# Altium project PCB_PROJECT1.PRJPCB
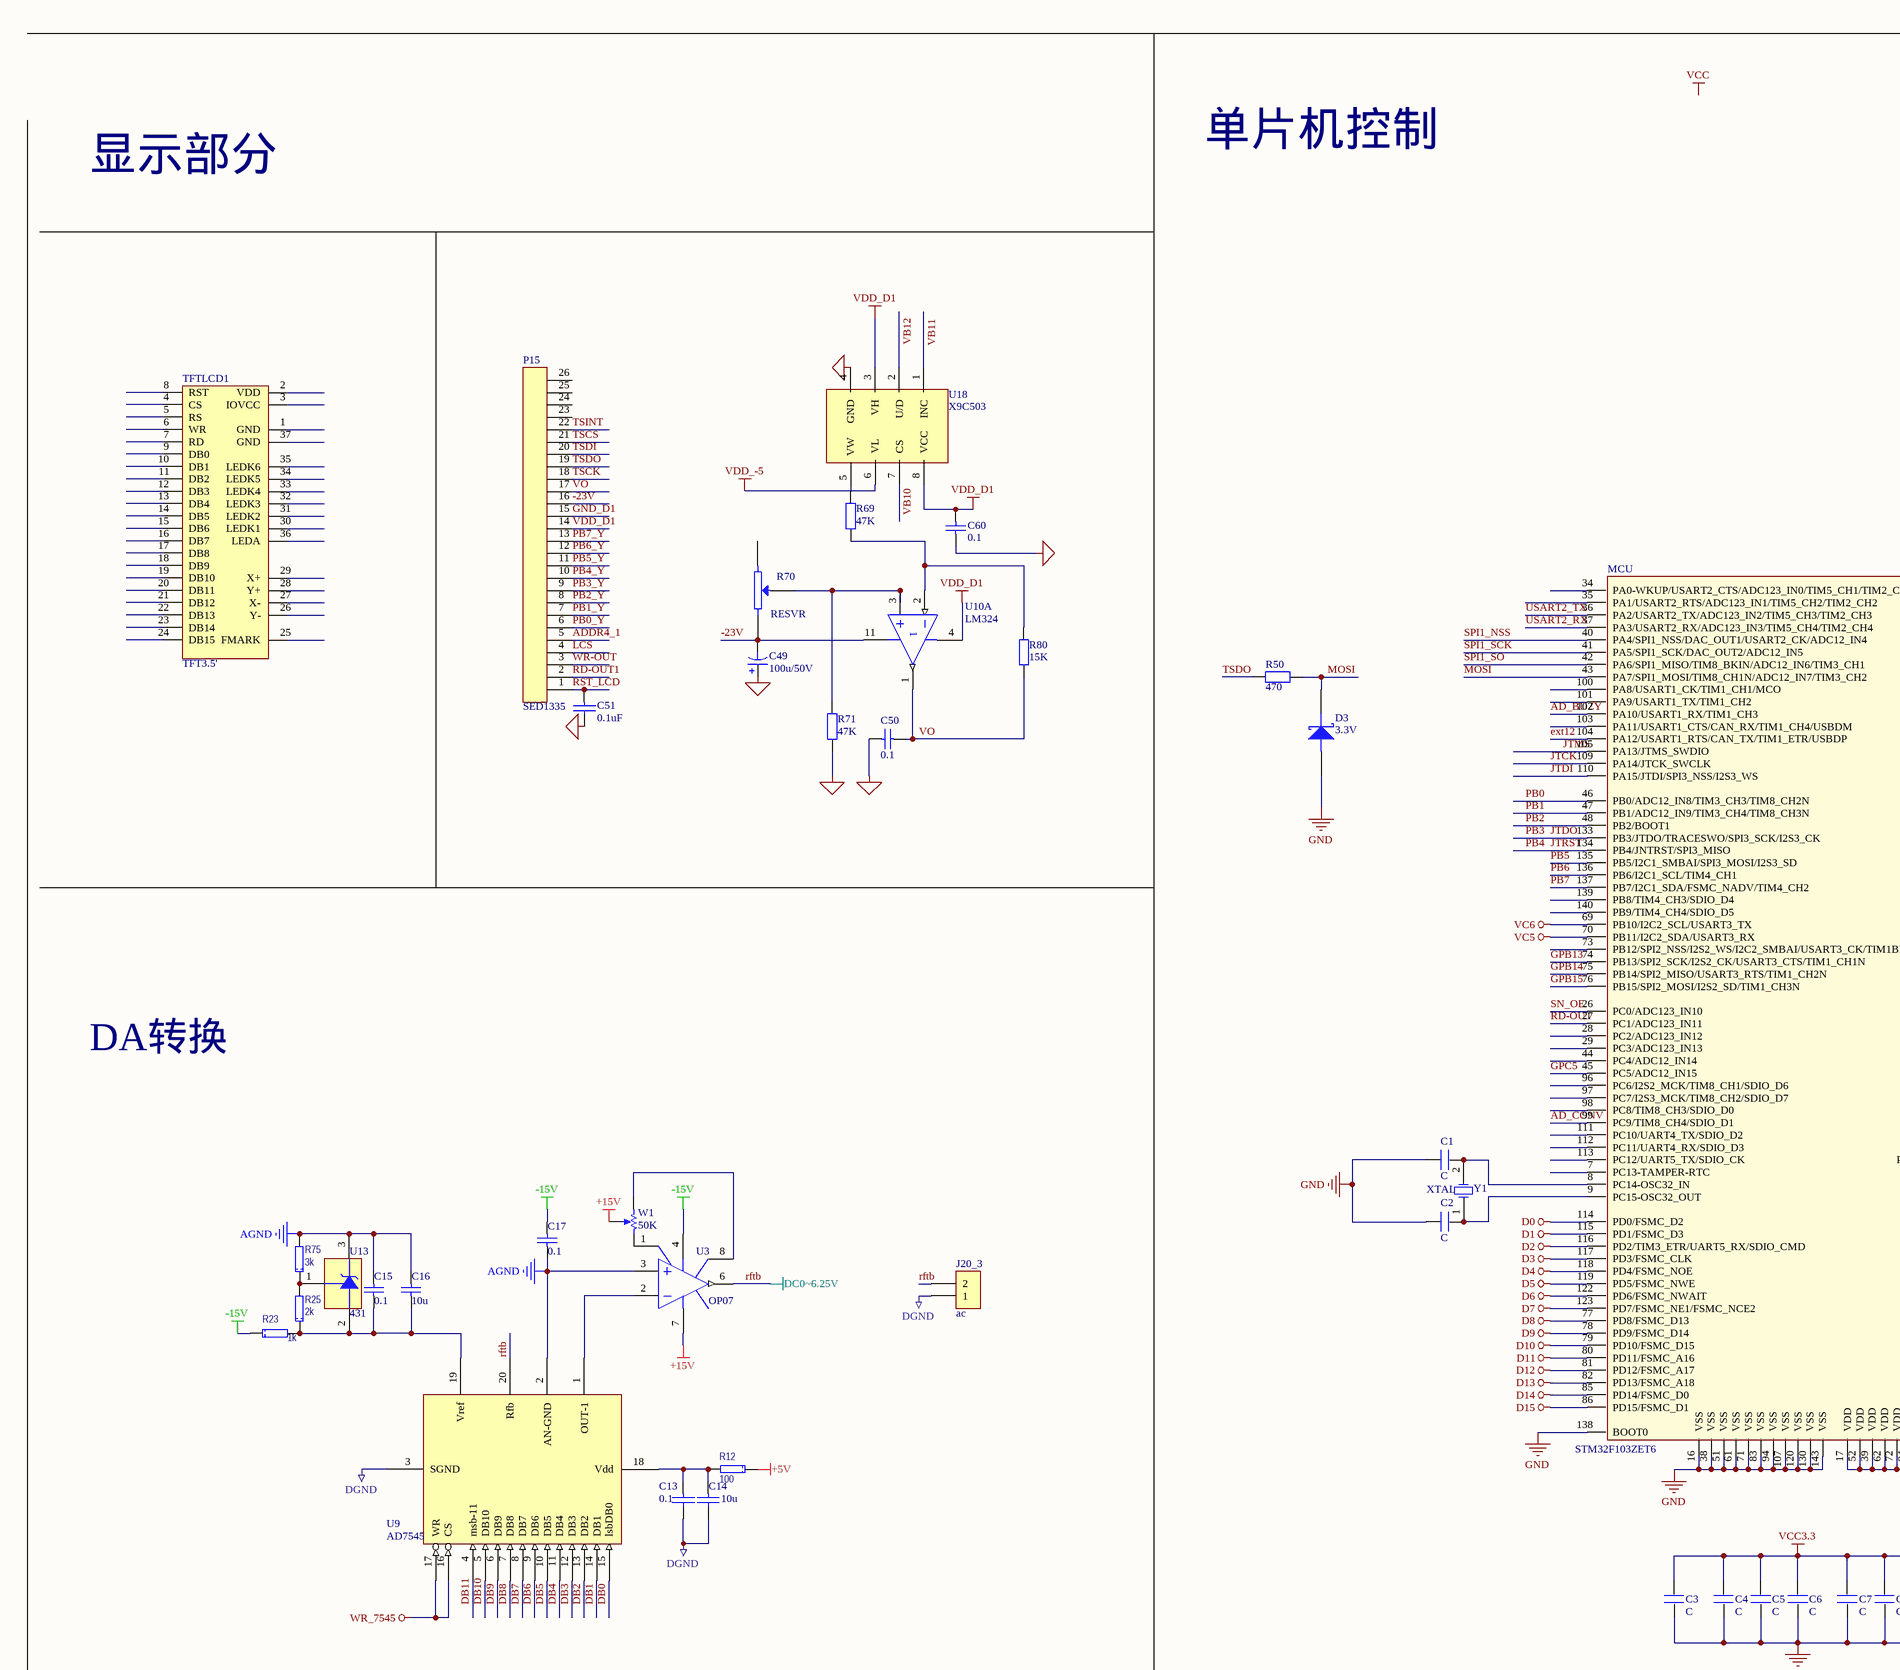
[diagram p0: T1.SCHDOC, top left]
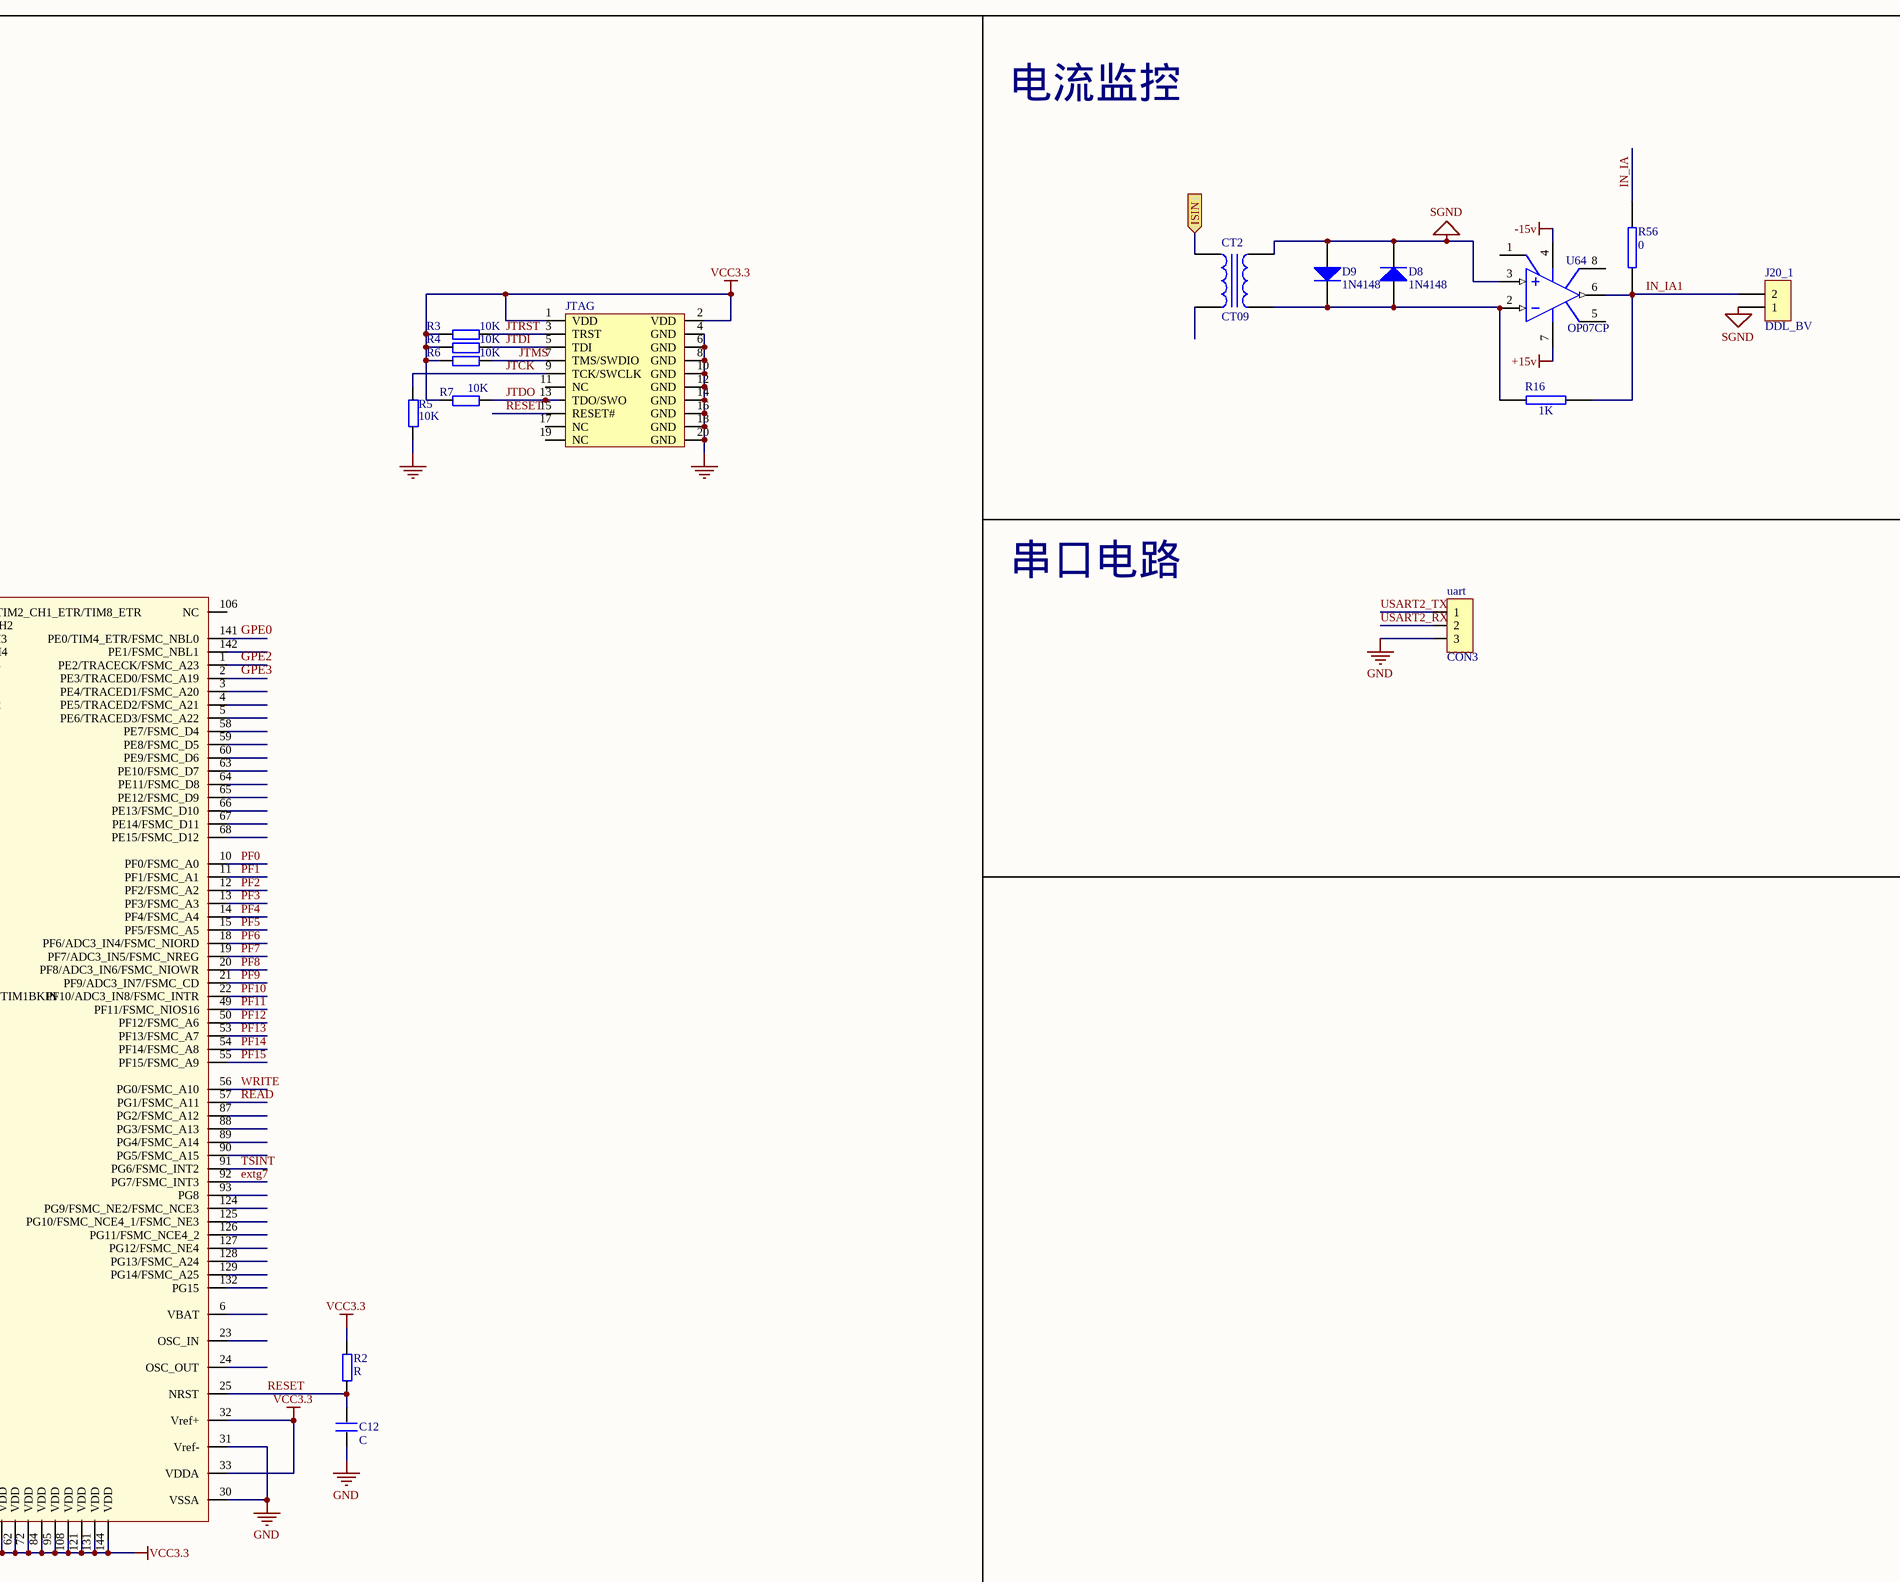
[diagram p1: T1.SCHDOC, top right]
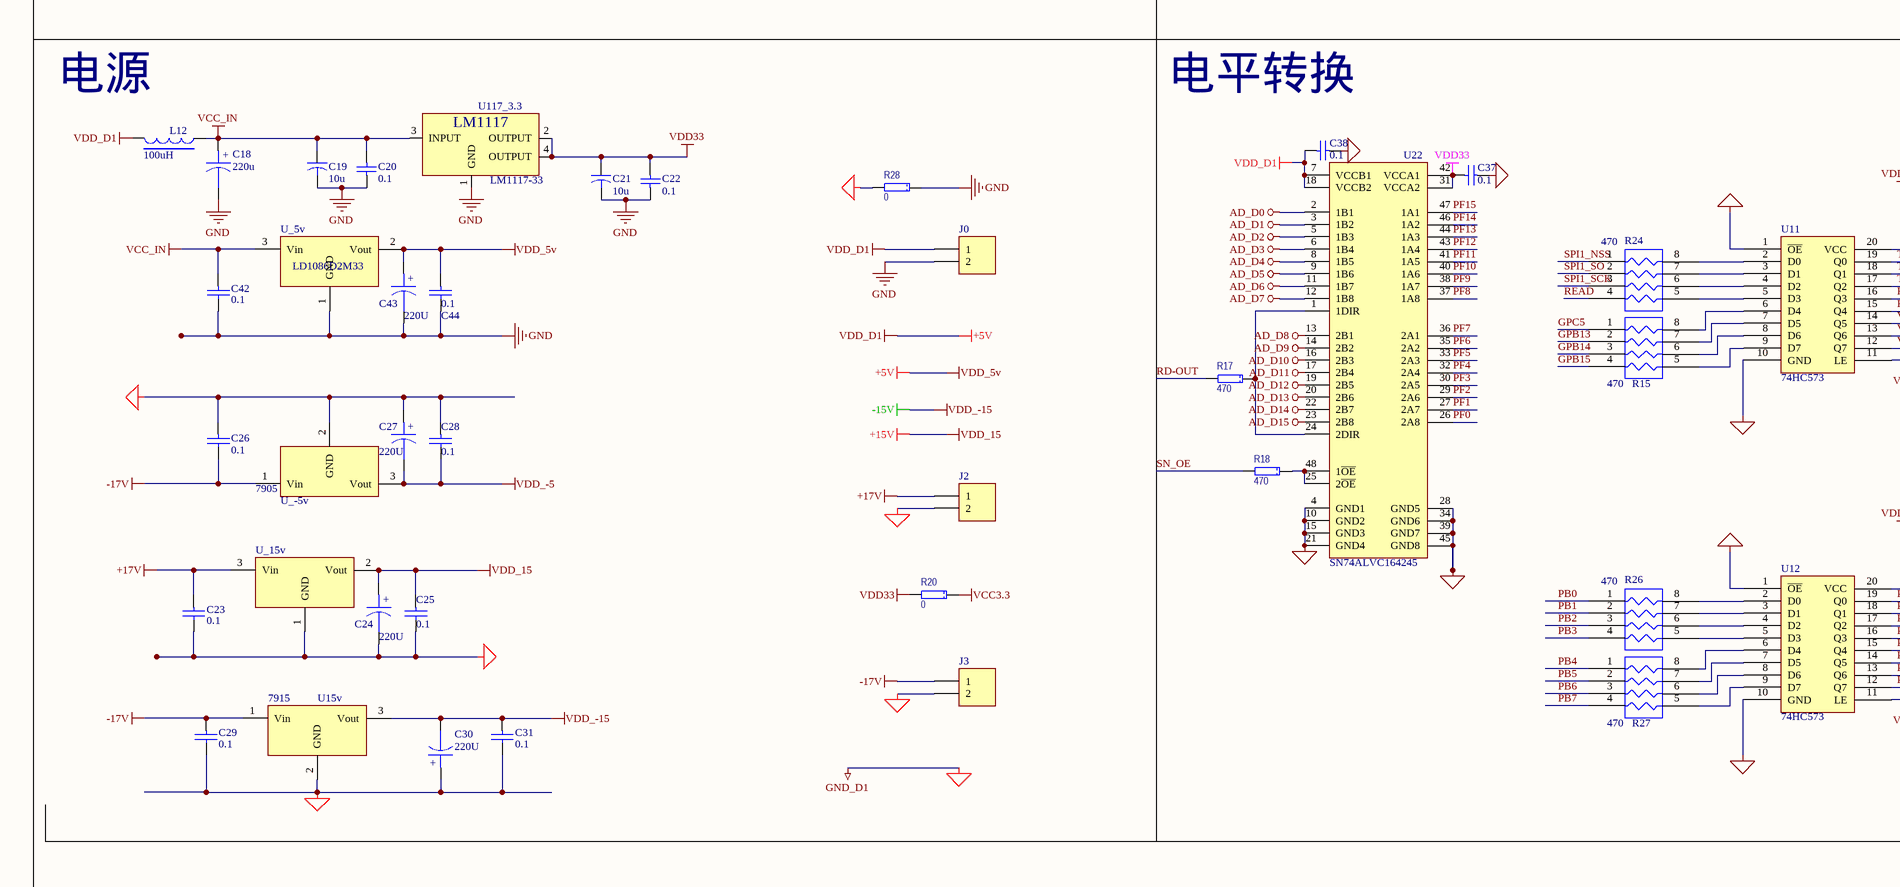
[diagram p2: T1.SCHDOC, bottom left]
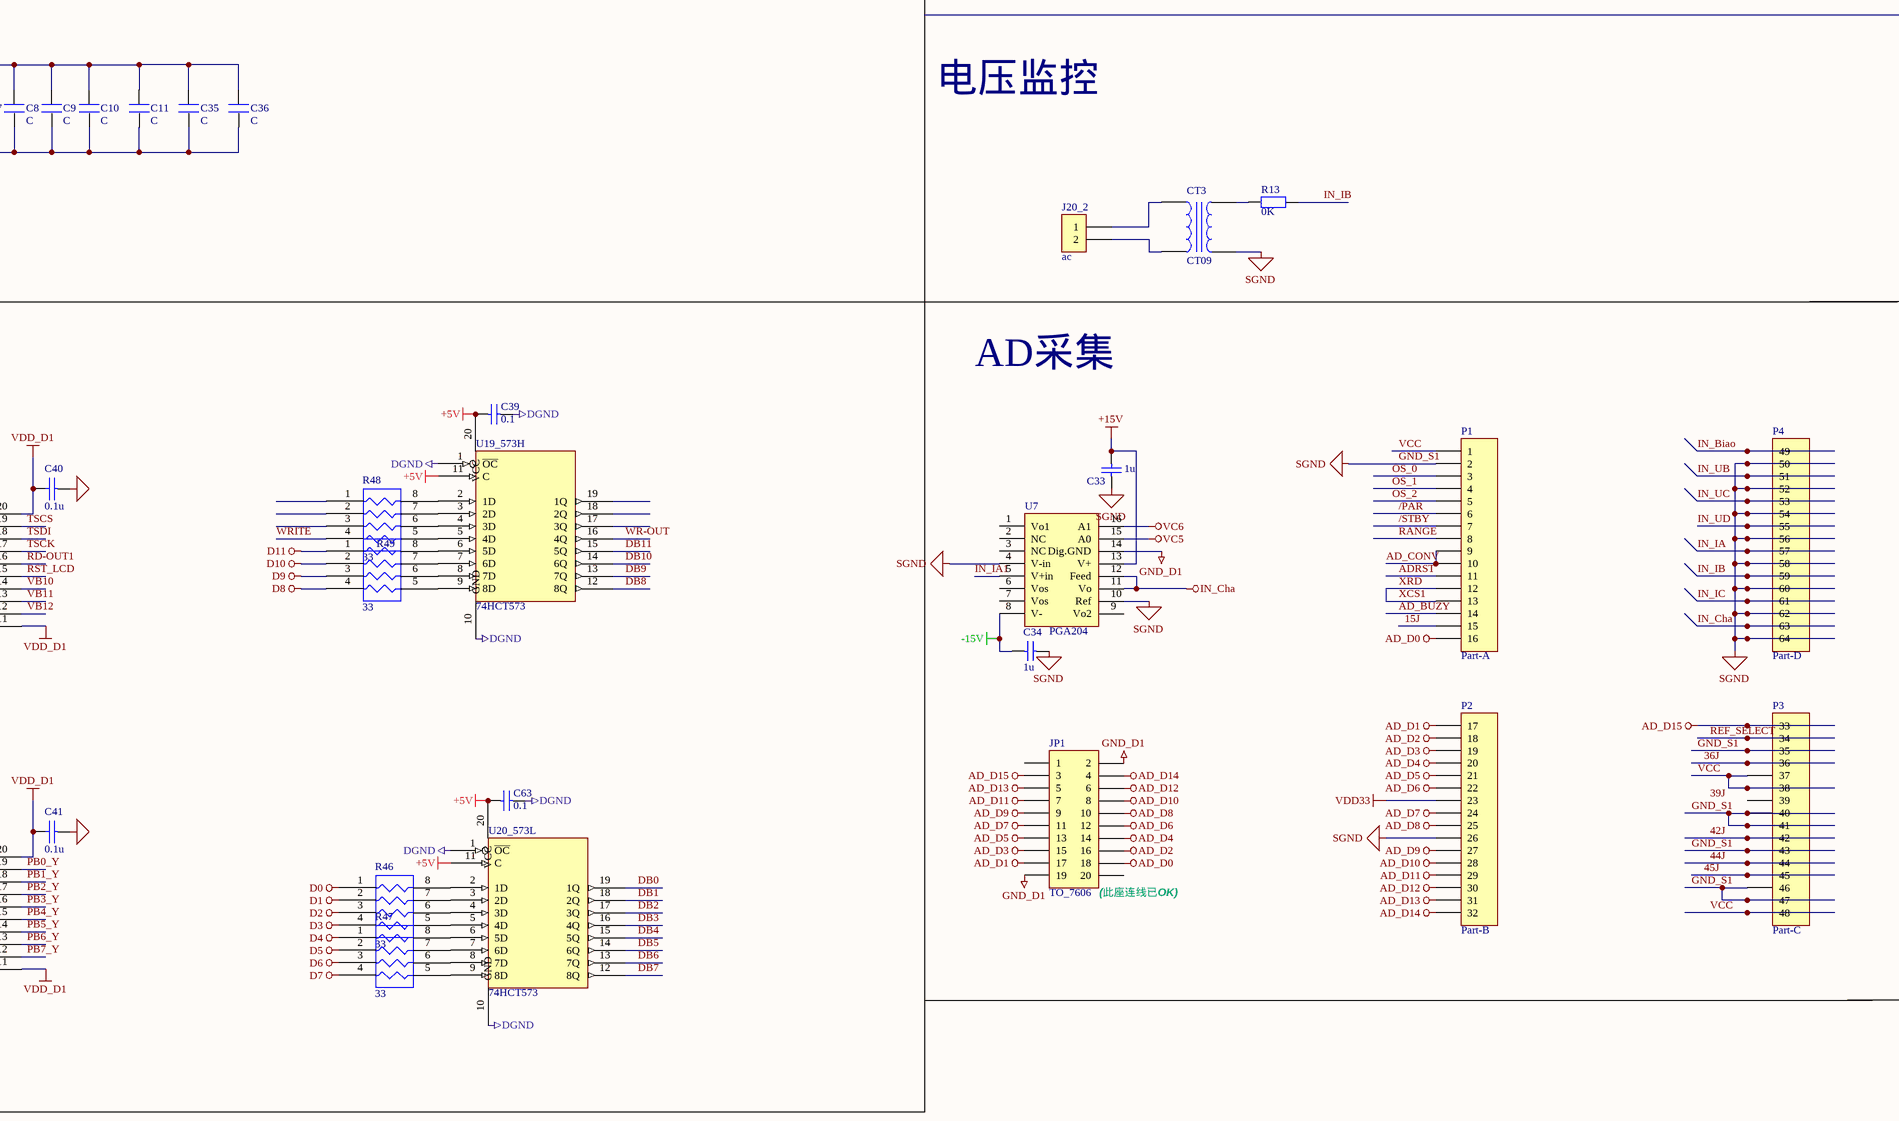
[diagram p3: T1.SCHDOC, bottom right]
1 sheet, 119 parts. Net scope: flat (ports and power ports of the same name join across sheets).
Board file: T1_MODIFYV1_0527.PCBDOC

## Sheet T1.SCHDOC
size A1

### Parts
C1  C  [0805]
C2  C  [0805]
C3  C  [0805]
C4  C  [0805]
C5  C  [0805]
C6  C  [0805]
C7  C  [0805]
C8  C  [0805]
C9  C  [0805]
C10  C  [0805]
C11  C  [0805]
C12  C  [0603P]
C13  0.1  [0805]
C14  10u  [0805]
C15  0.1  [0805]
C16  10u  [0805]
C17  0.1  [0805]
C18  220u  [C-RVE]
C19  10u  [c-1206]
C20  0.1  [0805]
C21  10u  [c-1206]
C22  0.1  [0805]
C23  0.1  [0805]
C24  220U  [CD10]
C25  0.1  [0805]
C26  0.1  [0805]
C27  220U  [CD4]
C28  0.1  [0805]
C29  0.1  [0805]
C30  220U  [CD4]
C31  0.1  [0805]
C33  1u  [0805]
C34  1u  [0805]
C35  C  [0805]
C36  C  [0805]
C37  0.1  [0805]
C38  0.1  [0805]
C39  0.1  [0805]
C40  0.1u  [0805]
C41  0.1u  [0805]
C42  0.1  [0805]
C43  220U  [CD10]
C44  0.1  [0805]
C49  100u/50V  [C-RVE]
C50  0.1  [0805]
C51  0.1uF  [0805]
C60  0.1  [0805]
C63  0.1  [0805]
CT2  CT09  [PCBComponent_1]
CT3  CT09  [tra1]
D3  3.3V  [DO-36]
D8  1N4148  [DO-41]
D9  1N4148  [DO-41]
J0  k TX  [HDR1X2]  (value not drawn)
J2  k TX  [HDR1X2]  (value not drawn)
J3  k TX  [HDR1X2]  (value not drawn)
J20_1  DDL_BV  [HDR1X2]
J20_2  ac  [RESVR]
J20_3  ac  [HDR1X2]
JP1  TO_7606  [IDC20_1]
JTAG  (no value)  [JTAG_20]
L12  100uH  [L1212]
MCU  STM32F103ZET6  [LQFP144]
P1  Part-A  [PARTA]
P2  Part-B  [PARTB]
P3  Part-C  [Part-C]
P4  Part-D  [Part-D]
P15  SED1335  [LCD_CM]
R2  R  [0805]
R3  10K  [0805]
R4  10K  [0805]
R5  10K  [0805]
R6  10K  [0805]
R7  10K  [0805]
R12  100  [0805]
R13  0K  [0805]
R15  470  [8P4R_0603]
R16  1K  [0805]
R17  470  [0805]
R18  470  [0805]
R20  0  [0805]
R23  1k  [0805]
R24  470  [8P4R_0603]
R25  2k  [0805]
R26  470  [8P4R_0603]
R27  470  [8P4R_0603]
R28  0  [0805]
R46  33  [8P4R_0603]
R47  33  [8P4R_0603]
R48  33  [8P4R_0603]
R49  33  [8P4R_0603]
R50  470  [0805]
R56  0  [0805]
R69  47K  [0805]
R70  RESVR  [RESVR]
R71  47K  [0805]
R75  3k  [0805]
R80  15K  [0805]
TFTLCD1  TFT3.5'  [TFT3.5']
U3  OP07  [DIP8]
U7  PGA204  [DIP16]
U9  AD7545  [DIP20]
U10  LM324  [SOP-14]  (part A of 4)
U11  74HC573  [SO20-7.5]
U12  74HC573  [SO20-7.5]
U13  431  [29-04]
U15v  7915  [TO220H]
U18  X9C503  [SOP127P600X175-8N]
U19_573H  74HCT573  [M20D]
U20_573L  74HCT573  [M20D]
U22  SN74ALVC164245  [SSOP48]
U64  OP07CP  [DIP8]
U117_3.3  LM1117-33  [SOT223]
U_5v  LD1086D2M33  [D2PAK/A]
U_15v  LD1086D2M33  [TO220F]  (value not drawn)
U_-5v  7905  [TO220H]
uart  CON3  [CON3]
W1  50K  [VR5]
Y1  XTAL  [XTAL_US]

### Ports
ISIN

### Nets
+15V: C24.1 C25.1 C33.2 U3.7(V+) U7.13(V+) U64.7(V+) U_15v.2(Vout) W1.2(TAP)  [also labelled VDD_15]
+17V: C23.1 J2.1 U_15v.3(Vin)
-15V: C17.2 C30.2 C31.1 C34.2 R23.1 U3.4(V-) U7.8(V-) U15v.3(Vout) U64.4(V-)  [also labelled VDD_-15]
-17V: C26.2 C29.1 J3.1 U15v.1(Vin) U_-5v.1(Vin)
AD_D0: JP1.18 P1.16 U22.2(1B1)
AD_D1: JP1.17 P2.17 U22.3(1B2)
AD_D2: JP1.16 P2.18 U22.5(1B3)
AD_D3: JP1.15 P2.19 U22.6(1B4)
AD_D4: JP1.14 P2.20 U22.8(1B5)
AD_D5: JP1.13 P2.21 U22.9(1B6)
AD_D6: JP1.12 P2.22 U22.11(1B7)
AD_D7: JP1.11 P2.24 U22.12(1B8)
AD_D8: JP1.10 P2.25 U22.13(2B1)
AD_D9: JP1.9 P2.27 U22.14(2B2)
AD_D10: JP1.8 P2.28 U22.16(2B3)
AD_D11: JP1.7 P2.29 U22.17(2B4)
AD_D12: JP1.6 P2.30 U22.19(2B5)
AD_D13: JP1.5 P2.31 U22.20(2B6)
AD_D14: JP1.4 P2.32 U22.22(2B7)
AD_D15: JP1.3 P3.33 U22.23(2B8)
AGND: C15.2 C16.2 C17.1 R75.2 U3.3(IN+) U9.2(AN-GND) U13.3(K)
D0: MCU.114(PD0/FSMC_D2) R46.1(R1)
D1: MCU.115(PD1/FSMC_D3) R46.2(R2)
D2: MCU.116(PD2/TIM3_ETR/UART5_RX/SDIO_CMD) R46.3(R3)
D3: MCU.117(PD3/FSMC_CLK) R46.4(R4)
D4: MCU.118(PD4/FSMC_NOE) R47.1(R1)
D5: MCU.119(PD5/FSMC_NWE) R47.2(R2)
D6: MCU.122(PD6/FSMC_NWAIT) R47.3(R3)
D7: MCU.123(PD7/FSMC_NE1/FSMC_NCE2) R47.4(R4)
D8: MCU.77(PD8/FSMC_D13) R49.4(R4)
D9: MCU.78(PD9/FSMC_D14) R49.3(R3)
D10: MCU.79(PD10/FSMC_D15) R49.2(R2)
D11: MCU.80(PD11/FSMC_A16) R49.1(R1)
D12: MCU.81(PD12/FSMC_A17)
D13: MCU.82(PD13/FSMC_A18)
D14: MCU.85(PD14/FSMC_D0)
D15: MCU.86(PD15/FSMC_D1)
DGND: C13.2 C14.2 C39.1 C63.1 J20_3.1 U9.3(SGND) U19_573H.1(~{OC}) U19_573H.10(GND) U20_573L.1(~{OC}) U20_573L.10(GND)
GND: C1.1 C2.1 C3.1 C4.1 C5.1 C6.1 C7.1 C8.1 C9.1 C10.1 C11.1 C12.1 C18.2 C19.2 C20.2 C21.2 C22.2 C35.1 C36.1 C42.2 C43.2 C44.2 D3.1(A) J0.2 JTAG.4(GND) JTAG.6(GND) JTAG.8(GND) JTAG.10(GND) JTAG.12(GND) JTAG.14(GND) JTAG.16(GND) JTAG.18(GND) JTAG.20(GND) MCU.16(VSS) MCU.30(VSSA) MCU.31(Vref-) MCU.38(VSS) MCU.51(VSS) MCU.61(VSS) MCU.71(VSS) MCU.83(VSS) MCU.94(VSS) MCU.107(VSS) MCU.120(VSS) MCU.130(VSS) MCU.138(BOOT0) MCU.143(VSS) R5.1 R28.1 U117_3.3.1(GND) U_5v.1(GND) uart.3
GND_D1: C23.2 C24.2 C25.2 C26.1 C27.1 C28.1 C29.2 C30.1 C31.2 C33.1 C34.1 C37.2 C38.2 C40.1 C41.1 C49.1 C50.1 C51.2 C60.1 CT2.2 CT3.1 D8.2(K) D9.1(A) J2.2 J3.2 J20_1.1 JP1.2 JP1.19 P1.2 P2.26 P3.35 P3.40 P3.41 P3.43 P3.46 P3.47 P4.50 P4.52 P4.54 P4.56 P4.58 P4.60 P4.62 P4.64 P15.15 R28.2 R71.2 U7.4(V-in) U7.10(Ref) U7.14(Dig.GND) U11.1(~{OE}) U11.10(GND) U12.1(~{OE}) U12.10(GND) U15v.2(GND) U18.4(GND) U22.4(GND1) U22.10(GND2) U22.15(GND3) U22.21(GND4) U22.28(GND5) U22.34(GND6) U22.39(GND7) U22.45(GND8) U64.3(IN+) U_15v.1(GND) U_-5v.2(GND)  [also labelled GND_S1, SGND]
IN_Cha: P4.63 U7.11(Vo) U7.12(Feed)
rftb: J20_3.2 U3.6(OUT) U9.20(Rfb)  [also labelled DC0~6.25V]
VC5: MCU.70(PB11/I2C2_SDA/USART3_RX) U7.15(A0)
VC6: MCU.69(PB10/I2C2_SCL/USART3_TX) U7.16(A1)
VCC: P1.1 P3.37 P3.38 P3.48
VCC3.3: C3.2 C4.2 C5.2 C6.2 C7.2 C8.2 C9.2 C10.2 C11.2 C35.2 C36.2 JTAG.1(VDD) JTAG.2(VDD) MCU.17(VDD) MCU.32(Vref+) MCU.33(VDDA) MCU.39(VDD) MCU.52(VDD) MCU.62(VDD) MCU.72(VDD) MCU.84(VDD) MCU.95(VDD) MCU.108(VDD) MCU.121(VDD) MCU.131(VDD) MCU.144(VDD) R2.2 R3.1 R4.1 R6.1 R7.1 R20.1
VCC_IN: C18.1 C19.1 C20.1 C42.1 L12.1 U117_3.3.3(INPUT) U_5v.3(Vin)
VDD33: C21.1 C22.1 C37.1 P2.23 R20.2 U22.31(VCCA2) U22.42(VCCA1) U117_3.3.2(OUTPUT) U117_3.3.4(OUTPUT)
VDD_-5: C27.2 C28.2 U18.6(VL) U_-5v.3(Vout)
VDD_D1: C38.1 C39.2 C40.2 C41.2 C43.1 C44.1 C60.2 C63.2 J0.1 L12.2 P15.14 R12.1 U10.4(V+) U11.11(LE) U11.20(VCC) U12.11(LE) U12.20(VCC) U18.3(VH) U18.8(VCC) U19_573H.11(C) U19_573H.20(VCC) U20_573L.11(C) U20_573L.20(VCC) U22.7(VCCB1) U22.18(VCCB2) U_5v.2(Vout)  [also labelled +5V, VDD_5v]
WR_7545: U9.16(CS) U9.17(WR)
15J: P1.15
36J: P3.36
42J: P3.42
44J: P3.44
45J: P3.45
-23V: C49.2 P15.16 R70.2 U10.11(V-)
/PAR: P1.6
/STBY: P1.7
AD_BUZY: MCU.102(PA10/USART1_RX/TIM1_CH3) P1.14
AD_CONV: MCU.99(PC9/TIM8_CH4/SDIO_D1) P1.9 P1.10
ADDR4_1: P15.5
ADRST: P1.11
DB0: U9.15(lsbDB0) U20_573L.19(1Q)
DB1: U9.14(DB1) U20_573L.18(2Q)
DB2: U9.13(DB2) U20_573L.17(3Q)
DB3: U9.12(DB3) U20_573L.16(4Q)
DB4: U9.11(DB4) U20_573L.15(5Q)
DB5: U9.10(DB5) U20_573L.14(6Q)
DB6: U9.9(DB6) U20_573L.13(7Q)
DB7: U9.8(DB7) U20_573L.12(8Q)
DB8: U9.7(DB8) U19_573H.12(8Q)
DB9: U9.6(DB9) U19_573H.13(7Q)
DB10: U9.5(DB10) U19_573H.14(6Q)
DB11: U9.4(msb-11) U19_573H.15(5Q)
ext12: MCU.104(PA12/USART1_RTS/CAN_TX/TIM1_ETR/USBDP)
extg7: MCU.92(PG7/FSMC_INT3)
GPB13: MCU.74(PB13/SPI2_SCK/I2S2_CK/USART3_CTS/TIM1_CH1N) R15.2(R2)
GPB14: MCU.75(PB14/SPI2_MISO/USART3_RTS/TIM1_CH2N) R15.3(R3)
GPB15: MCU.76(PB15/SPI2_MOSI/I2S2_SD/TIM1_CH3N) R15.4(R4)
GPC5: MCU.45(PC5/ADC12_IN15) R15.1(R1)
GPE0: MCU.141(PE0/TIM4_ETR/FSMC_NBL0)
GPE2: MCU.1(PE2/TRACECK/FSMC_A23)
GPE3: MCU.2(PE3/TRACED0/FSMC_A19)
IN_Biao: P4.49
IN_IA: P4.57 R56.2
IN_IA1: J20_1.2 R16.2 R56.1 U7.5(V+in) U64.6(OUT)
IN_IB: P4.59 R13.2
IN_IC: P4.61
IN_UB: P4.51
IN_UC: P4.53
IN_UD: P4.55
JTCK: JTAG.9(TCK/SWCLK) MCU.109(PA14/JTCK_SWCLK) R5.2
JTDI: JTAG.5(TDI) MCU.110(PA15/JTDI/SPI3_NSS/I2S3_WS) R4.2
JTDO: JTAG.13(TDO/SWO) MCU.133(PB3/JTDO/TRACESWO/SPI3_SCK/I2S3_CK) R7.2 R26.4(R4)  [also labelled PB3]
JTMS: JTAG.7(TMS/SWDIO) MCU.105(PA13/JTMS_SWDIO) R6.2
JTRST: JTAG.3(TRST) MCU.134(PB4/JNTRST/SPI3_MISO) R3.2 R27.1(R1)  [also labelled PB4]
LCS: P15.4
MOSI: D3.2(K) MCU.43(PA7/SPI1_MOSI/TIM8_CH1N/ADC12_IN7/TIM3_CH2) R50.2
OS_0: P1.3
OS_1: P1.4
OS_2: P1.5
PB0: MCU.46(PB0/ADC12_IN8/TIM3_CH3/TIM8_CH2N) R26.1(R1)
PB0_Y: P15.6 U12.19(Q0)
PB1: MCU.47(PB1/ADC12_IN9/TIM3_CH4/TIM8_CH3N) R26.2(R2)
PB1_Y: P15.7 U12.18(Q1)
PB2: MCU.48(PB2/BOOT1) R26.3(R3)
PB2_Y: P15.8 U12.17(Q2)
PB3_Y: P15.9 U12.16(Q3)
PB4_Y: P15.10 U12.15(Q4)
PB5: MCU.135(PB5/I2C1_SMBAI/SPI3_MOSI/I2S3_SD) R27.2(R2)
PB5_Y: P15.11 U12.14(Q5)
PB6: MCU.136(PB6/I2C1_SCL/TIM4_CH1) R27.3(R3)
PB6_Y: P15.12 U12.13(Q6)
PB7: MCU.137(PB7/I2C1_SDA/FSMC_NADV/TIM4_CH2) R27.4(R4)
PB7_Y: P15.13 U12.12(Q7)
PF0: MCU.10(PF0/FSMC_A0) U22.26(2A8)
PF1: MCU.11(PF1/FSMC_A1) U22.27(2A7)
PF2: MCU.12(PF2/FSMC_A2) U22.29(2A6)
PF3: MCU.13(PF3/FSMC_A3) U22.30(2A5)
PF4: MCU.14(PF4/FSMC_A4) U22.32(2A4)
PF5: MCU.15(PF5/FSMC_A5) U22.33(2A3)
PF6: MCU.18(PF6/ADC3_IN4/FSMC_NIORD) U22.35(2A2)
PF7: MCU.19(PF7/ADC3_IN5/FSMC_NREG) U22.36(2A1)
PF8: MCU.20(PF8/ADC3_IN6/FSMC_NIOWR) U22.37(1A8)
PF9: MCU.21(PF9/ADC3_IN7/FSMC_CD) U22.38(1A7)
PF10: MCU.22(PF10/ADC3_IN8/FSMC_INTR) U22.40(1A6)
PF11: MCU.49(PF11/FSMC_NIOS16) U22.41(1A5)
PF12: MCU.50(PF12/FSMC_A6) U22.43(1A4)
PF13: MCU.53(PF13/FSMC_A7) U22.44(1A3)
PF14: MCU.54(PF14/FSMC_A8) U22.46(1A2)
PF15: MCU.55(PF15/FSMC_A9) U22.47(1A1)
RANGE: P1.8
RD-OUT: MCU.27(PC1/ADC123_IN11) R17.2
RD-OUT1: P15.2 U11.16(Q3)
READ: MCU.57(PG1/FSMC_A11) R24.4(R4)
REF_SELECT: P3.34
RESET: C12.2 JTAG.15(RESET#) MCU.25(NRST) R2.1
RST_LCD: C51.1 P15.1 U11.15(Q4)
SN_OE: MCU.26(PC0/ADC123_IN10) R18.2
SPI1_NSS: MCU.40(PA4/SPI1_NSS/DAC_OUT1/USART2_CK/ADC12_IN4) R24.1(R1)
SPI1_SCK: MCU.41(PA5/SPI1_SCK/DAC_OUT2/ADC12_IN5) R24.3(R3)
SPI1_SO: MCU.42(PA6/SPI1_MISO/TIM8_BKIN/ADC12_IN6/TIM3_CH1) R24.2(R2)
TSCK: P15.18 U11.17(Q2)
TSCS: P15.21 U11.19(Q0)
TSDI: P15.20 U11.18(Q1)
TSDO: P15.19 R50.1
TSINT: MCU.91(PG6/FSMC_INT2) P15.22
USART2_RX: MCU.37(PA3/USART2_RX/ADC123_IN3/TIM5_CH4/TIM2_CH4) uart.2
USART2_TX: MCU.36(PA2/USART2_TX/ADC123_IN2/TIM5_CH3/TIM2_CH3) uart.1
VB10: U11.14(Q5) U18.7(CS)
VB11: U11.13(Q6) U18.1(INC)
VB12: U11.12(Q7) U18.2(U/D)
VO: C50.2 P15.17 R80.2 U10.1(OUT)
WR-OUT: P15.3 U19_573H.16(4Q)
WRITE: MCU.56(PG0/FSMC_A10) R48.4(R4)
XCS1: P1.12 P1.13  [also labelled XRD]
NetC1_2: C1.2 MCU.8(PC14-OSC32_IN) Y1.2(OSC2)
NetC2_2: C2.2 MCU.9(PC15-OSC32_OUT) Y1.1(OSC1)
NetC13_1: C13.1 C14.1 R12.2 U9.18(Vdd)
NetC15_1: C15.1 C16.1 R23.2 R25.1 U9.19(Vref) U13.2(A)
NetCT2_1: CT2.1 D8.1(A) D9.2(K) R16.1 U64.2(IN-)
NetCT2_3: CT2.3 ; port ISIN
NetCT3_2: CT3.2 R13.1
NetCT3_3: CT3.3 J20_2.1
NetCT3_4: CT3.4 J20_2.2
NetR15_5: R15.5(R4) U11.9(D7)
NetR15_6: R15.6(R3) U11.8(D6)
NetR15_7: R15.7(R2) U11.7(D5)
NetR15_8: R15.8(R1) U11.6(D4)
NetR17_1: R17.1 U22.1(1DIR) U22.24(2DIR)
NetR18_1: R18.1 U22.25(2~{OE}) U22.48(1~{OE})
NetR24_5: R24.5(R4) U11.5(D3)
NetR24_6: R24.6(R3) U11.4(D2)
NetR24_7: R24.7(R2) U11.3(D1)
NetR24_8: R24.8(R1) U11.2(D0)
NetR25_2: R25.2 R75.1 U13.1(REF)
NetR26_5: R26.5(R4) U12.5(D3)
NetR26_6: R26.6(R3) U12.4(D2)
NetR26_7: R26.7(R2) U12.3(D1)
NetR26_8: R26.8(R1) U12.2(D0)
NetR27_5: R27.5(R4) U12.9(D7)
NetR27_6: R27.6(R3) U12.8(D6)
NetR27_7: R27.7(R2) U12.7(D5)
NetR27_8: R27.8(R1) U12.6(D4)
NetR46_5: R46.5(R4) U20_573L.5(4D)
NetR46_6: R46.6(R3) U20_573L.4(3D)
NetR46_7: R46.7(R2) U20_573L.3(2D)
NetR46_8: R46.8(R1) U20_573L.2(1D)
NetR47_5: R47.5(R4) U20_573L.9(8D)
NetR47_6: R47.6(R3) U20_573L.8(7D)
NetR47_7: R47.7(R2) U20_573L.7(6D)
NetR47_8: R47.8(R1) U20_573L.6(5D)
NetR48_5: R48.5(R4) U19_573H.5(4D)
NetR48_6: R48.6(R3) U19_573H.4(3D)
NetR48_7: R48.7(R2) U19_573H.3(2D)
NetR48_8: R48.8(R1) U19_573H.2(1D)
NetR49_5: R49.5(R4) U19_573H.9(8D)
NetR49_6: R49.6(R3) U19_573H.8(7D)
NetR49_7: R49.7(R2) U19_573H.7(6D)
NetR49_8: R49.8(R1) U19_573H.6(5D)
NetR69_1: R69.1 U18.5(VW)
NetR69_2: R69.2 R80.1 U10.2(IN-)
NetR70_3: R70.3(W) R71.1 U10.3(IN+)
NetU3_1: U3.1(NULL1) W1.1(TOP)
NetU3_2: U3.2(IN-) U9.1(OUT-1)
NetU3_8: U3.8(NULL2) W1.3(BOT)

Not connected (* = marked no-connect by the designer): CT2 4; JP1 1 20; JTAG 11(NC) 17(NC) 19(NC); MCU 3(PE4/TRACED1/FSMC_A20) 4(PE5/TRACED2/FSMC_A21) 5(PE6/TRACED3/FSMC_A22) 6(VBAT) 7(PC13-TAMPER-RTC) 23(OSC_IN) 24(OSC_OUT) 28(PC2/ADC123_IN12) 29(PC3/ADC123_IN13) 34(PA0-WKUP/USART2_CTS/ADC123_IN0/TIM5_CH1/TIM2_CH1_ETR/TIM8_ETR) 35(PA1/USART2_RTS/ADC123_IN1/TIM5_CH2/TIM2_CH2) 44(PC4/ADC12_IN14) 58(PE7/FSMC_D4) 59(PE8/FSMC_D5) 60(PE9/FSMC_D6) 63(PE10/FSMC_D7) 64(PE11/FSMC_D8) 65(PE12/FSMC_D9) 66(PE13/FSMC_D10) 67(PE14/FSMC_D11) 68(PE15/FSMC_D12) 73(PB12/SPI2_NSS/I2S2_WS/I2C2_SMBAI/USART3_CK/TIM1BKIN) 87(PG2/FSMC_A12) 88(PG3/FSMC_A13) 89(PG4/FSMC_A14) 90(PG5/FSMC_A15) 93(PG8) 96(PC6/I2S2_MCK/TIM8_CH1/SDIO_D6) 97(PC7/I2S3_MCK/TIM8_CH2/SDIO_D7) 98(PC8/TIM8_CH3/SDIO_D0) 100(PA8/USART1_CK/TIM1_CH1/MCO) 101(PA9/USART1_TX/TIM1_CH2) 103(PA11/USART1_CTS/CAN_RX/TIM1_CH4/USBDM) 106(NC) 111(PC10/UART4_TX/SDIO_D2) 112(PC11/UART4_RX/SDIO_D3) 113(PC12/UART5_TX/SDIO_CK) 124(PG9/FSMC_NE2/FSMC_NCE3) 125(PG10/FSMC_NCE4_1/FSMC_NE3) 126(PG11/FSMC_NCE4_2) 127(PG12/FSMC_NE4) 128(PG13/FSMC_A24) 129(PG14/FSMC_A25) 132(PG15) 139(PB8/TIM4_CH3/SDIO_D4) 140(PB9/TIM4_CH4/SDIO_D5) 142(PE1/FSMC_NBL1); P3 39; P15 23 24 25 26; R48 1(R1) 2(R2) 3(R3); R70 1; TFTLCD1 1(GND) 2(VDD) 3(IOVCC) 4(CS) 5(RS) 6(WR) 7(RD) 8(RST) 9(DB0) 10(DB1) 11(DB2) 12(DB3) 13(DB4) 14(DB5) 15(DB6) 16(DB7) 17(DB8) 18(DB9) 19(DB10) 20(DB11) 21(DB12) 22(DB13) 23(DB14) 24(DB15) 25(FMARK) 26(Y-) 27(X-) 28(Y+) 29(X+) 30(LEDK1) 31(LEDK2) 32(LEDK3) 33(LEDK4) 34(LEDK5) 35(LEDK6) 36(LEDA) 37(GND); U3 5(NC); U7 1(Vo1) 2(NC) 3(NC) 6(Vos) 7(Vos) 9(Vo2); U19_573H 17(3Q) 18(2Q) 19(1Q); U64 1(NULL1) 5(NC) 8(NULL2)

### Notes on the sheet
- 单片机控制
- 电流监控
- 显示部分
- 串口电路
- DA转换
- 电压监控
- 电源
- 电平转换
- AD采集
- (near JP1) (此座连线已OK)
- Labels drawn without touching a wire or pin: 39J, DGND, VCC
- (in symbol CAPACITOR POL) +

### Library data of the parts
C13 C14 C23 C25 C26 C28 C29 C31 C40-C42 C44 C51 = CAP: Capacitor
C15-C17 = Cap_5: Capacitor; Value: 0.1u; Published: 8-Jun-2000; LatestRevisionDate: 17-Jul-2002; LatestRevisionNote: Re-released for DXP Platform.; Publisher: Altium Limited
C18 C24 C27 C30 C43 = CAPACITOR POL: Capacitor
C19 C21 = Cap2: Capacitor; Value: 0.1u; Published: 23-Sep-2002; Publisher: Altium Limited
C20 C22 C33 C34 C37-C39 C50 C60 C63 = Cap: Capacitor; Value: 0.1u; Published: 8-Jun-2000; LatestRevisionDate: 17-Jul-2002; LatestRevisionNote: Re-released for DXP Platform.; Publisher: Altium Limited
  C20 C22 C37-C39 C50 C60 C63: PackageReference: RAD-0.3
C49 = Cap Pol1: Polarized Capacitor (Radial); Value: 0.1u; Published: 8-Jun-2000; LatestRevisionDate: 17-Jul-2002; LatestRevisionNote: Re-released for DXP Platform.; Publisher: Altium Limited
D3 = DIODE SCHOTTKY: Schottky Diode
D8 D9 = Diode 1N4007: 1 Amp General Purpose Rectifier; Published: 8-Jun-2000; LatestRevisionDate: 17-Jul-2002; LatestRevisionNote: Re-released for DXP Platform.; DatasheetDocument: 1998; PackageDocument: Aug-1999; PackageReference: DO-41; Publisher: Altium Limited; Code_JEDEC: DO-204-AL; ComponentLink1Description: Manufacturer Link; ComponentLink1URL: http://www.fairchildsemi.com/; ComponentLink2Description: Datasheet; ComponentLink2URL: http://www.fairchildsemi.com/ds/1N%2F1N4001.pdf
J0 J2 J3 = Header 2: Header, 2-Pin; LatestRevisionDate: 17-Jul-2002; LatestRevisionNote: Re-released for DXP Platform.; Publisher: Altium Limited
J20_1 J20_3 = CON2: Connector
J20_2 = CON2: Connector; pin to pad: 2>3
JP1 = Header 10X2: Header, 10-Pin, Dual row; LatestRevisionDate: 17-Jul-2002; LatestRevisionNote: Re-released for DXP Platform.; Publisher: Altium Limited
JTAG = JTAG
L12 = INDUCTOR2
P1-P4 = Header 16: Header, 16-Pin; LatestRevisionDate: 17-Jul-2002; LatestRevisionNote: Re-released for DXP Platform.; Publisher: Altium Limited
P15 = 26PIN
R3-R7 = R
R12 R23 R25 R75 = RES
R13 = Res2: Resistor; Value: 47K; Published: 8-Jun-2000; LatestRevisionDate: 17-Jul-2002; LatestRevisionNote: Re-released for DXP Platform.; PackageReference: AXIAL-0.4; Publisher: Altium Limited
R15 R24 R26 R27 R46-R49 = RP4R: Text Field1: 30; Text Field2: 50
R16 R56 = RES2
R17 R18 R20 R28 = Res
R50 = Res2: Resistor; Value: 15K; Published: 8-Jun-2000; LatestRevisionDate: 17-Jul-2002; LatestRevisionNote: Re-released for DXP Platform.; PackageReference: AXIAL-0.4; Publisher: Altium Limited
R69 R71 R80 = Res2: Resistor; Published: 8-Jun-2000; LatestRevisionDate: 17-Jul-2002; LatestRevisionNote: Re-released for DXP Platform.; PackageReference: AXIAL-0.4; Publisher: Altium Limited
  R69 R71: Value: 47K
  R80: Value: 15K
R70 = RESVR: Potentiometer; pin to pad: 1>0 2>1 3>2
TFTLCD1 = TFT3.5': 3.5寸,带触摸,分辨率:480*320
U3 U64 = OP07CN: Very Low Offset Single Bipolar Operational Amplifier; Text Field6: Pins 5 is Not Connected; Text Field7: Published 24-Aug-2001
U7 = PGA205: Text Field1: PGA205
U10 = LM324AJ: Quadruple Operational Amplifier; Published: 15-Apr-2002; DatasheetDocument: Jan-1989; PackageDocument: Jun-1999; PackageReference: J014; Publisher: Altium Limited
U13 = TL431ACLP: Programmable Precision Reference; PackageDocument: 1996; Published: 15-Apr-2002; DatasheetDocument: 1999; PackageReference: 29-04; Publisher: Altium Limited
U15v U_-5v = VOLTREG: pin to pad: 1>2 2>1
U18 = Component_1
U19_573H U20_573L = 74HC573
U22 = IC_SN74ALVC164245
U117_3.3 = LM1117
U_5v = LM1086
U_15v = LM1086: pin to pad: 1>2 2>3 3>1
uart = CON3: Connector
W1 = RPot: Potentiometer; Sim Note: Enter the Resistance value and the set point into parameter fields.; Set Position: 0.5; Value: 10K; Published: 8-Jun-2000; LatestRevisionDate: 17-Jul-2002; LatestRevisionNote: Re-released for DXP Platform.; Publisher: Altium Limited
Y1 = XTAL: Crystal Oscillator; Published: *; LatestRevisionDate: *; LatestRevisionNote: *; Publisher: *